# EAGLE design BreakoutBoard (EAGLE 9.6.2)

## Sheet 1 of 2: Audio & Power
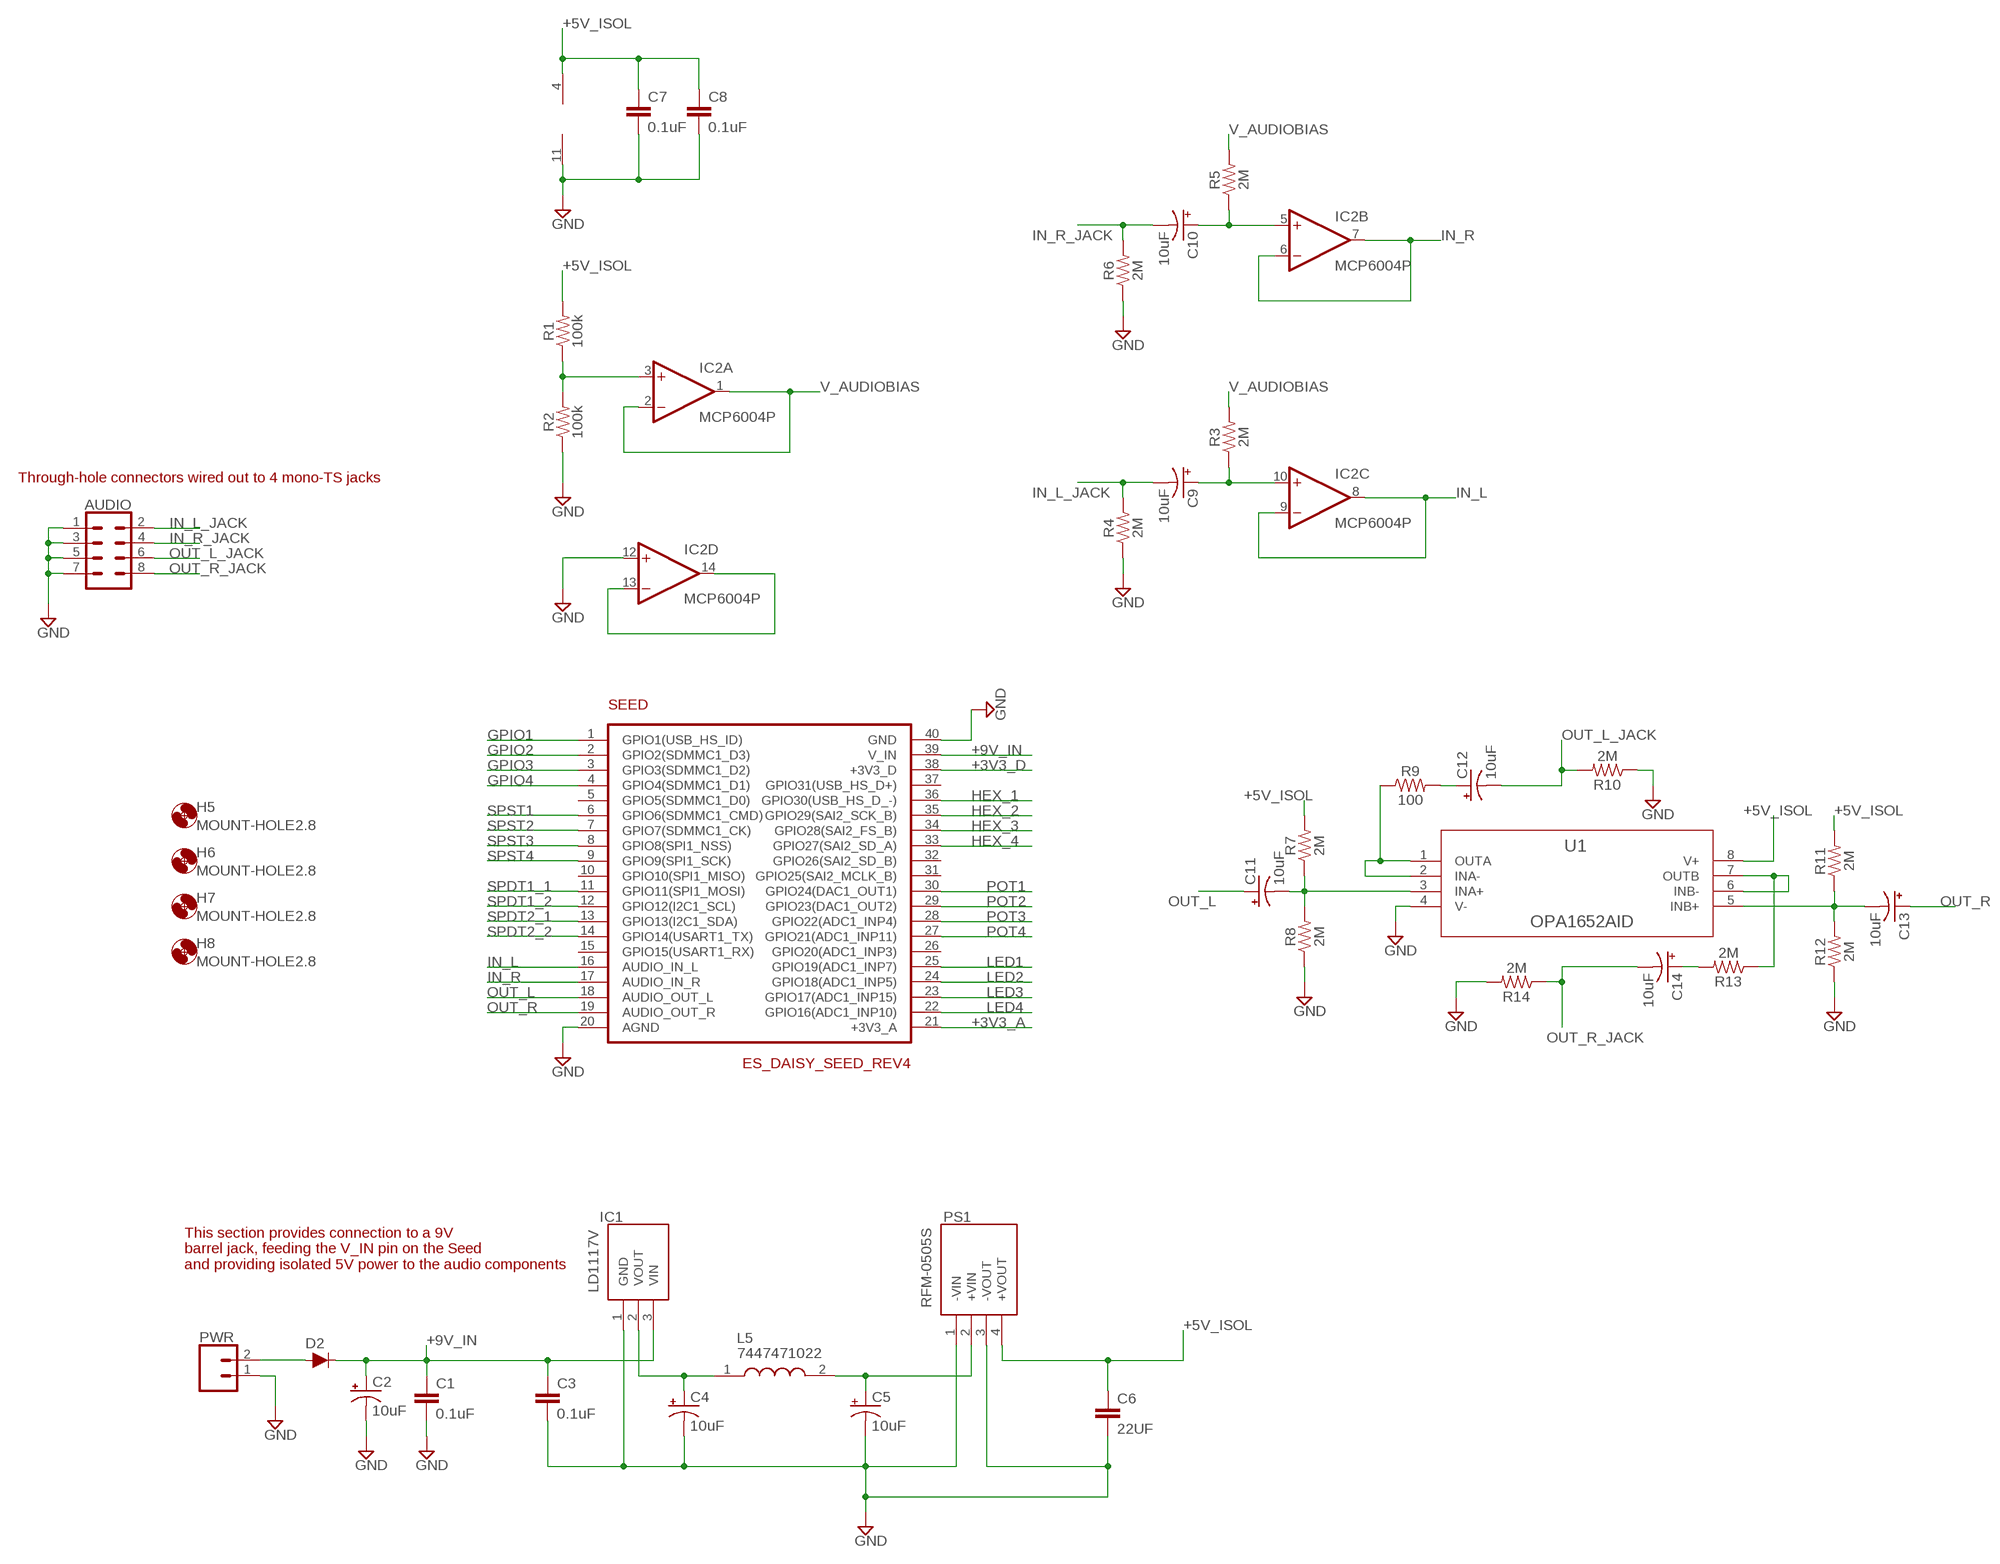
[diagram p0: schematic, sheet 1]

### Parts
AUDIO  CONN_04X2  [2X4]
C1  0.1uF  0.1UF-KIT-EZ-50V-20%  [CAP-PTH-SMALL-KIT]
C2  10uF  10UF-POLAR-RADIAL-2.5MM-25V-20%  [CPOL-RADIAL-2.5MM-5MM]
C3  0.1uF  0.1UF-KIT-EZ-50V-20%  [CAP-PTH-SMALL-KIT]
C4  10uF  10UF-POLAR-RADIAL-2.5MM-25V-20%  [CPOL-RADIAL-2.5MM-5MM]
C5  10uF  10UF-POLAR-RADIAL-2.5MM-25V-20%  [CPOL-RADIAL-2.5MM-5MM]
C6  22UF  [CAP-PTH-SMALL-KIT]
C7  0.1uF  0.1UF-KIT-EZ-50V-20%  [CAP-PTH-SMALL-KIT]
C8  0.1uF  0.1UF-KIT-EZ-50V-20%  [CAP-PTH-SMALL-KIT]
C9  10uF  10UF-POLAR-RADIAL-2.5MM-25V-20%  [CPOL-RADIAL-2.5MM-5MM]
C10  10uF  10UF-POLAR-RADIAL-2.5MM-25V-20%  [CPOL-RADIAL-2.5MM-5MM]
C11  10uF  10UF-POLAR-RADIAL-2.5MM-25V-20%  [CPOL-RADIAL-2.5MM-5MM]
C12  10uF  10UF-POLAR-RADIAL-2.5MM-25V-20%  [CPOL-RADIAL-2.5MM-5MM]
C13  10uF  10UF-POLAR-RADIAL-2.5MM-25V-20%  [CPOL-RADIAL-2.5MM-5MM]
C14  10uF  10UF-POLAR-RADIAL-2.5MM-25V-20%  [CPOL-RADIAL-2.5MM-5MM]
D2  200mA/100V/1V  DIODE-1N4148  [DIODE-1N4148]
H5  MOUNT-HOLE2.8  [2,8]
H6  MOUNT-HOLE2.8  [2,8]
H7  MOUNT-HOLE2.8  [2,8]
H8  MOUNT-HOLE2.8  [2,8]
IC1  LD1117V  [TO255P460X1020X2008-3P]
IC2  MCP6004P  [DIL14]
L5  7447471022  [WE-TIS_111190]
PS1  RFM-0505S  [RFM0505S]
PWR  CONN_02  [1X02]
R1  100k  100KOHM-HORIZ-1/4W-5%  [AXIAL-0.3]
R2  100k  100KOHM-HORIZ-1/4W-5%  [AXIAL-0.3]
R3  2M  2MOHM-HORIZ-1/4W-5%  [AXIAL-0.3]
R4  2M  2MOHM-HORIZ-1/4W-5%  [AXIAL-0.3]
R5  2M  2MOHM-HORIZ-1/4W-5%  [AXIAL-0.3]
R6  2M  2MOHM-HORIZ-1/4W-5%  [AXIAL-0.3]
R7  2M  2MOHM-HORIZ-1/4W-5%  [AXIAL-0.3]
R8  2M  2MOHM-HORIZ-1/4W-5%  [AXIAL-0.3]
R9  100  100OHM-HORIZ-1/4W-1%  [AXIAL-0.3]
R10  2M  2MOHM-HORIZ-1/4W-5%  [AXIAL-0.3]
R11  2M  2MOHM-HORIZ-1/4W-5%  [AXIAL-0.3]
R12  2M  2MOHM-HORIZ-1/4W-5%  [AXIAL-0.3]
R13  2M  2MOHM-HORIZ-1/4W-5%  [AXIAL-0.3]
R14  2M  2MOHM-HORIZ-1/4W-5%  [AXIAL-0.3]
SEED  ES_DAISY_SEED_REV4  [ES_DAISY_SEED]
U1  OPA1652AID  [D8]

### Nets
+3V3_A: SEED.21(+3V3_A) ; also sheet 2
+3V3_D: SEED.38(+3V3_D)
+5V_ISOL: C6.1 C7.1 C8.1 IC2.4(P:V+) PS1.4(+VOUT) R1.P$2 R7.P$2 R11.P$2 U1.8(V+)
+9V_IN: C1.1 C2.1(+) C3.1 D2.C IC1.3(VIN) SEED.39(V_IN)
GND: AUDIO.1 AUDIO.3 AUDIO.5 AUDIO.7 C1.2 C2.2(-) C3.2 C4.2(-) C5.2(-) C6.2 C7.2 C8.2 IC1.1(GND) IC2.11(P:V-) IC2.12(D:+IN) PS1.1(-VIN) PS1.3(-VOUT) PWR.1 R2.P$1 R4.P$1 R6.P$1 R8.P$1 R10.P$1 R12.P$1 R14.P$2 SEED.20(AGND) SEED.40(GND) U1.4(V-) ; also sheet 2
GPIO1: SEED.1(GPIO1(USB_HS_ID)) ; also sheet 2
GPIO2: SEED.2(GPIO2(SDMMC1_D3)) ; also sheet 2
GPIO3: SEED.3(GPIO3(SDMMC1_D2)) ; also sheet 2
GPIO4: SEED.4(GPIO4(SDMMC1_D1)) ; also sheet 2
HEX_1: SEED.36(GPIO30(USB_HS_D_-)) ; also sheet 2
HEX_2: SEED.35(GPIO29(SAI2_SCK_B)) ; also sheet 2
HEX_3: SEED.34(GPIO28(SAI2_FS_B)) ; also sheet 2
HEX_4: SEED.33(GPIO27(SAI2_SD_A)) ; also sheet 2
IN_L: IC2.8(C:OUT) IC2.9(C:-IN) SEED.16(AUDIO_IN_L)
IN_L_JACK: AUDIO.2 C9.2(-) R4.P$2
IN_R: IC2.6(B:-IN) IC2.7(B:OUT) SEED.17(AUDIO_IN_R)
IN_R_JACK: AUDIO.4 C10.2(-) R6.P$2
LED1: SEED.25(GPIO19(ADC1_INP7)) ; also sheet 2
LED2: SEED.24(GPIO18(ADC1_INP5)) ; also sheet 2
LED3: SEED.23(GPIO17(ADC1_INP15)) ; also sheet 2
LED4: SEED.22(GPIO16(ADC1_INP10)) ; also sheet 2
N$2: D2.A PWR.2
N$6: IC2.3(A:+IN) R1.P$1 R2.P$2
N$7: C5.1(+) L5.2 PS1.2(+VIN)
N$8: C4.1(+) IC1.2(VOUT) L5.1
N$9: C9.1(+) IC2.10(C:+IN) R3.P$1
N$10: IC2.13(D:-IN) IC2.14(D:OUT)
N$11: C10.1(+) IC2.5(B:+IN) R5.P$1
N$12: C11.2(-) R7.P$1 R8.P$2 U1.3(INA+)
N$13: R9.P$1 U1.1(OUTA) U1.2(INA-)
N$14: C12.1(+) R9.P$2
N$15: C13.2(-) R11.P$1 R12.P$2 U1.5(INB+)
N$16: C14.1(+) R13.P$2
N$17: R13.P$1 U1.6(INB-) U1.7(OUTB)
OUT_L: C11.1(+) SEED.18(AUDIO_OUT_L)
OUT_L_JACK: AUDIO.6 C12.2(-) R10.P$2
OUT_R: C13.1(+) SEED.19(AUDIO_OUT_R)
OUT_R_JACK: AUDIO.8 C14.2(-) R14.P$1
POT1: SEED.30(GPIO24(DAC1_OUT1)) ; also sheet 2
POT2: SEED.29(GPIO23(DAC1_OUT2)) ; also sheet 2
POT3: SEED.28(GPIO22(ADC1_INP4)) ; also sheet 2
POT4: SEED.27(GPIO21(ADC1_INP11)) ; also sheet 2
SPDT1_1: SEED.11(GPIO11(SPI1_MOSI)) ; also sheet 2
SPDT1_2: SEED.12(GPIO12(I2C1_SCL)) ; also sheet 2
SPDT2_1: SEED.13(GPIO13(I2C1_SDA)) ; also sheet 2
SPDT2_2: SEED.14(GPIO14(USART1_TX)) ; also sheet 2
SPST1: SEED.6(GPIO6(SDMMC1_CMD)) ; also sheet 2
SPST2: SEED.7(GPIO7(SDMMC1_CK)) ; also sheet 2
SPST3: SEED.8(GPIO8(SPI1_NSS)) ; also sheet 2
SPST4: SEED.9(GPIO9(SPI1_SCK)) ; also sheet 2
V_AUDIOBIAS: IC2.1(A:OUT) IC2.2(A:-IN) R3.P$2 R5.P$2
Unconnected: SEED.5(GPIO5(SDMMC1_D0)) SEED.10(GPIO10(SPI1_MISO)) SEED.15(GPIO15(USART1_RX)) SEED.26(GPIO20(ADC1_INP3)) SEED.31(GPIO25(SAI2_MCLK_B)) SEED.32(GPIO26(SAI2_SD_B)) SEED.37(GPIO31(USB_HS_D+))

### Notes on the sheet
- Through-hole connectors wired out to 4 mono-TS jacks
- This section provides connection to a 9V
  barrel jack, feeding the V_IN pin on the Seed 
  and providing isolated 5V power to the audio components

## Sheet 2 of 2: I/O
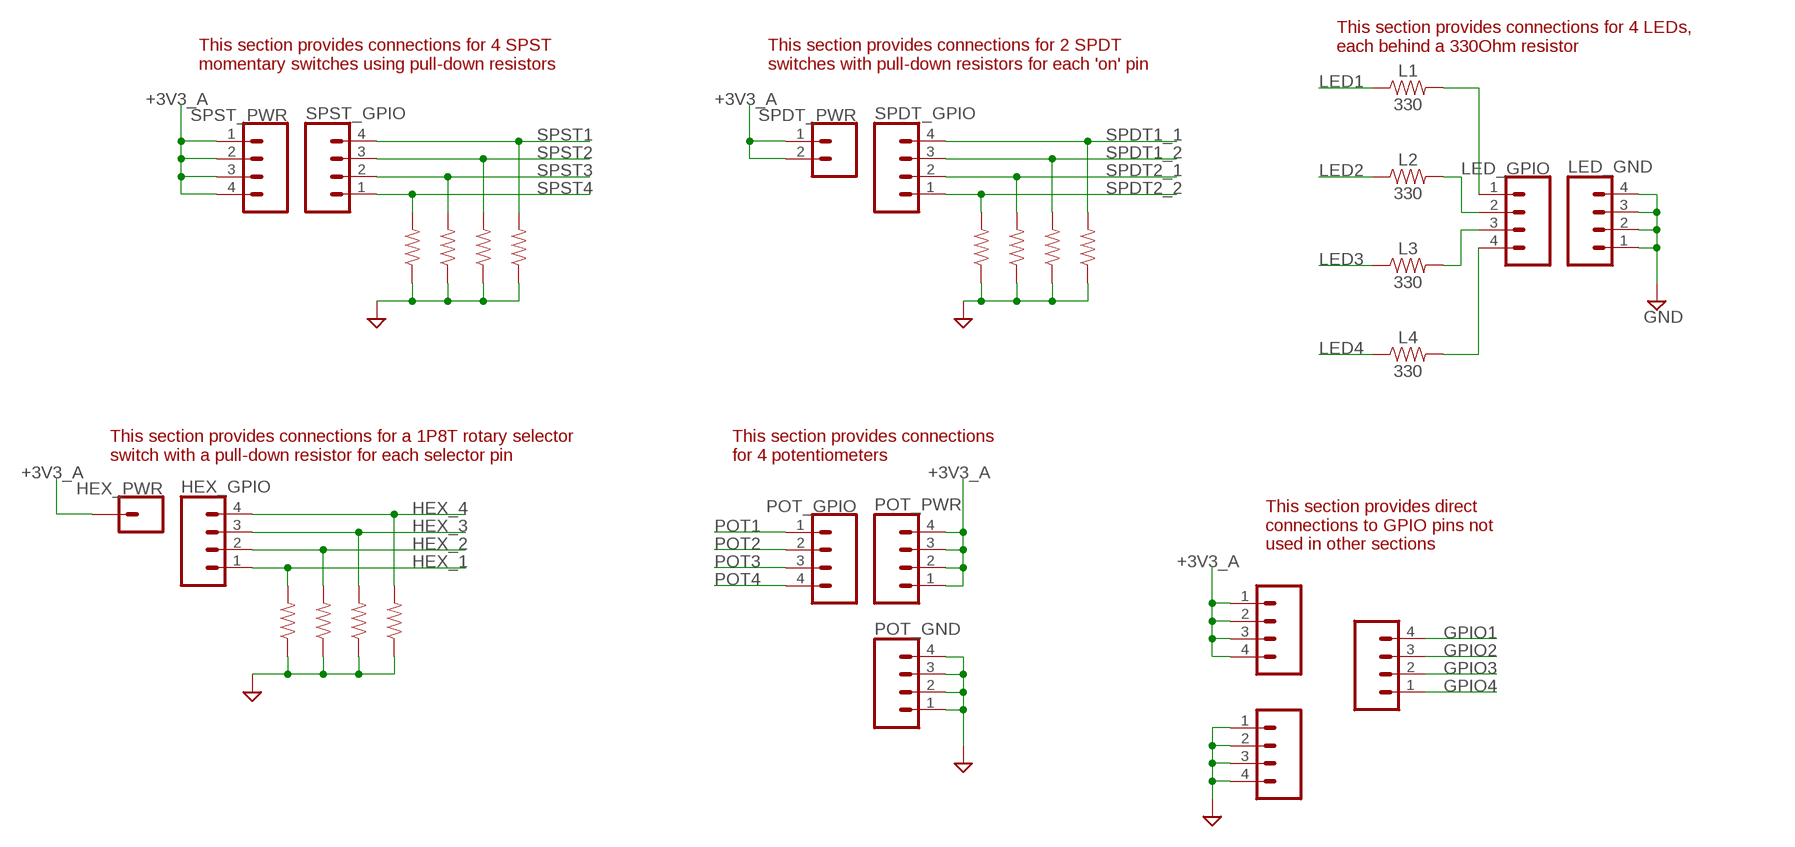
[diagram p1: schematic, sheet 2]

### Parts
D11  10k  10KOHM-HORIZ-1/4W-5%  [AXIAL-0.3]
D12  10k  10KOHM-HORIZ-1/4W-5%  [AXIAL-0.3]
D21  10k  10KOHM-HORIZ-1/4W-5%  [AXIAL-0.3]
D22  10k  10KOHM-HORIZ-1/4W-5%  [AXIAL-0.3]
EX_GND  CONN_04  [1X04]
EX_GPIOS  CONN_04  [1X04]
EX_PWR  CONN_04  [1X04]
H1  10k  10KOHM-HORIZ-1/4W-5%  [AXIAL-0.3]
H2  10k  10KOHM-HORIZ-1/4W-5%  [AXIAL-0.3]
H3  10k  10KOHM-HORIZ-1/4W-5%  [AXIAL-0.3]
H4  10k  10KOHM-HORIZ-1/4W-5%  [AXIAL-0.3]
HEX_GPIO  CONN_04  [1X04]
HEX_PWR  CONN_01  [1X01]
L1  330  330OHM-HORIZ-1/10W-5%  [AXIAL-0.3]
L2  330  330OHM-HORIZ-1/10W-5%  [AXIAL-0.3]
L3  330  330OHM-HORIZ-1/10W-5%  [AXIAL-0.3]
L4  330  330OHM-HORIZ-1/10W-5%  [AXIAL-0.3]
LED_GND  CONN_04  [1X04]
LED_GPIO  CONN_04  [1X04]
POT_GND  CONN_04  [1X04]
POT_GPIO  CONN_04  [1X04]
POT_PWR  CONN_04  [1X04]
S1  10k  10KOHM-HORIZ-1/4W-5%  [AXIAL-0.3]
S2  10k  10KOHM-HORIZ-1/4W-5%  [AXIAL-0.3]
S3  10k  10KOHM-HORIZ-1/4W-5%  [AXIAL-0.3]
S4  10k  10KOHM-HORIZ-1/4W-5%  [AXIAL-0.3]
SPDT_GPIO  CONN_04  [1X04]
SPDT_PWR  CONN_02  [1X02]
SPST_GPIO  CONN_04  [1X04]
SPST_PWR  CONN_04  [1X04]

### Nets
+3V3_A: EX_PWR.1 EX_PWR.2 EX_PWR.3 EX_PWR.4 HEX_PWR.1 POT_PWR.1 POT_PWR.2 POT_PWR.3 POT_PWR.4 SPDT_PWR.1 SPDT_PWR.2 SPST_PWR.1 SPST_PWR.2 SPST_PWR.3 SPST_PWR.4 ; also sheet 1
GND: D11.P$1 D12.P$1 D21.P$1 D22.P$1 EX_GND.1 EX_GND.2 EX_GND.3 EX_GND.4 H1.P$1 H2.P$1 H3.P$1 H4.P$1 LED_GND.1 LED_GND.2 LED_GND.3 LED_GND.4 POT_GND.1 POT_GND.2 POT_GND.3 POT_GND.4 S1.P$1 S2.P$1 S3.P$1 S4.P$1 ; also sheet 1
GPIO1: EX_GPIOS.4 ; also sheet 1
GPIO2: EX_GPIOS.3 ; also sheet 1
GPIO3: EX_GPIOS.2 ; also sheet 1
GPIO4: EX_GPIOS.1 ; also sheet 1
HEX_1: H1.P$2 HEX_GPIO.1 ; also sheet 1
HEX_2: H2.P$2 HEX_GPIO.2 ; also sheet 1
HEX_3: H3.P$2 HEX_GPIO.3 ; also sheet 1
HEX_4: H4.P$2 HEX_GPIO.4 ; also sheet 1
LED1: L1.P$1 ; also sheet 1
LED2: L2.P$1 ; also sheet 1
LED3: L3.P$1 ; also sheet 1
LED4: L4.P$1 ; also sheet 1
N$1: L1.P$2 LED_GPIO.1
N$3: L2.P$2 LED_GPIO.2
N$4: L3.P$2 LED_GPIO.3
N$5: L4.P$2 LED_GPIO.4
POT1: POT_GPIO.1 ; also sheet 1
POT2: POT_GPIO.2 ; also sheet 1
POT3: POT_GPIO.3 ; also sheet 1
POT4: POT_GPIO.4 ; also sheet 1
SPDT1_1: D11.P$2 SPDT_GPIO.4 ; also sheet 1
SPDT1_2: D12.P$2 SPDT_GPIO.3 ; also sheet 1
SPDT2_1: D21.P$2 SPDT_GPIO.2 ; also sheet 1
SPDT2_2: D22.P$2 SPDT_GPIO.1 ; also sheet 1
SPST1: S1.P$2 SPST_GPIO.4 ; also sheet 1
SPST2: S2.P$2 SPST_GPIO.3 ; also sheet 1
SPST3: S3.P$2 SPST_GPIO.2 ; also sheet 1
SPST4: S4.P$2 SPST_GPIO.1 ; also sheet 1

### Notes on the sheet
- This section provides connections for 4 LEDs,
  each behind a 330Ohm resistor
- This section provides connections for 4 SPST 
  momentary switches using pull-down resistors
- This section provides connections for 2 SPDT 
  switches with pull-down resistors for each 'on' pin
- This section provides connections for a 1P8T rotary selector
  switch with a pull-down resistor for each selector pin
- This section provides connections
  for 4 potentiometers
- This section provides direct
  connections to GPIO pins not
  used in other sections

## Library data of the parts
AUDIO = SparkFun-Connectors:CONN_04X2: Multi connection point. Often used as Generic Header-pin footprint for 0.1 inch spaced/style header connections On any of the 0.1 inch spaced packages, you can populate with these: Break Away Headers - Straight <https://www.sparkfun.com/products/116> (PRT-00116) Break Away Male Headers - Right Angle <https://www.sparkfun.com/products/553> (PRT-00553) Female Headers <https://www.sparkfun.com/products/115> (PRT-00115) Break Away Headers - Machine Pin <https://www.sparkfun.com/products/117> (PRT-00117) Break Away Female Headers - Swiss Machine Pin <https://www.sparkfun.com/products/743> (PRT-00743)
C1 C3 C7 C8 = SparkFun-Capacitors:0.1UF: 0.1µF ceramic capacitors A capacitor is a passive two-terminal electrical component used to store electrical energy temporarily in an electric field.; PROD_ID: CAP-08370
C2 C4 C5 C9-C14 = SparkFun-Capacitors:10UF-POLAR: 10.0µF polarized capacitors A capacitor is a passive two-terminal electrical component used to store electrical energy temporarily in an electric field.; PROD_ID: CAP-08440
C6 = Custom-Parts:22UF
D2 = SparkFun-DiscreteSemi:DIODE: Diode These are standard reverse protection diodes and small signal diodes. SparkFun Products: SparkFun SparkPunk Sound Kit <https://www.sparkfun.com/products/11177> SparkFun ESP8266 Thing <https://www.sparkfun.com/products/13231>; PROD_ID: DIO-08378
D11 D12 D21 D22 H1-H4 S1-S4 = SparkFun-Resistors:10KOHM: 10kΩ resistor A resistor is a passive two-terminal electrical component that implements electrical resistance as a circuit element. Resistors act to reduce current flow, and, at the same time, act to lower voltage levels within circuits. - Wikipedia; PROD_ID: RES-09435
EX_GND EX_GPIOS EX_PWR HEX_GPIO LED_GND LED_GPIO POT_GND POT_GPIO POT_PWR SPDT_GPIO SPST_GPIO SPST_PWR = SparkFun-Connectors:CONN_04: Multi connection point. Often used as Generic Header-pin footprint for 0.1 inch spaced/style header connections On any of the 0.1 inch spaced packages, you can populate with these: Break Away Headers - Straight <https://www.sparkfun.com/products/116> (PRT-00116) Break Away Male Headers - Right Angle <https://www.sparkfun.com/products/553> (PRT-00553) Female Headers <https://www.sparkfun.com/products/115> (PRT-00115) Break Away Headers - Machine Pin <https://www.sparkfun.com/products/117> (PRT-00117) Break Away Female Headers - Swiss Machine Pin <https://www.sparkfun.com/products/743> (PRT-00743) For SCREWTERMINALS and SPRING TERMINALS visit here: Screw Terimnals on SparkFun.com <https://www.sparkfun.com/search/results?term=Screw+Terminals> (5mm/3.5mm/2.54mm spacing) This device is also useful as a general connection point to wire up your design to another part of your project. Our various solder wires solder well into these plated through hole pads. Hook-Up Wire - Assortment (Stranded, 22 AWG) <https://www.sparkfun.com/products/11375> (PRT-11375) Hook-Up Wire - Assortment (Solid Core, 22 AWG) <https://www.sparkfun.com/products/11367> (PRT-11367) View the entire wire category on our website here <https://www.sparkfun.com/categories/141> Special notes: Molex polarized connector foot print use with SKU : PRT-08231 with associated crimp pins and housings. 1MM SMD Version SKU: PRT-10208; PROD_ID: CONN-09696
H5-H8 = holes:MOUNT-HOLE: MOUNTING HOLE with drill center marker
HEX_PWR = SparkFun-Connectors:CONN_01: Single connection point. Often used as Generic Header-pin footprint for 0.1 inch spaced/style header connections On any of the 0.1 inch spaced packages, you can populate with these: Break Away Headers - Straight <https://www.sparkfun.com/products/116> (PRT-00116) Break Away Male Headers - Right Angle <https://www.sparkfun.com/products/553> (PRT-00553) Female Headers <https://www.sparkfun.com/products/115> (PRT-00115) Break Away Headers - Machine Pin <https://www.sparkfun.com/products/117> (PRT-00117) Break Away Female Headers - Swiss Machine Pin <https://www.sparkfun.com/products/743> (PRT-00743) This device is also useful as a general connection point to wire up your design to another part of your project. Our various solder wires solder well into these plated through hole pads. Hook-Up Wire - Assortment (Stranded, 22 AWG) <https://www.sparkfun.com/products/11375> (PRT-11375) Hook-Up Wire - Assortment (Solid Core, 22 AWG) <https://www.sparkfun.com/products/11367> (PRT-11367) View the entire wire category on our website here <https://www.sparkfun.com/categories/141> Special notes: SMTSO-256-ET is a "flush mount" nut for a 4-40 screw. We mostly use this on specialty testbeds; it is a nice way to connect hardware to your PCB at an adjustable hieght. Also note, the SNAP packages are for using a snappable style connector. We sell a baggie of snaps and they are also used on two LilyPad designs: Snap Assortment - 30 pack (male and female) <https://www.sparkfun.com/products/11347> (DEV-11347) LilyPad Arduino SimpleSnap <https://www.sparkfun.com/products/10941> (DEV-10941) LilyPad SimpleSnap Protoboard <https://www.sparkfun.com/products/10940> (DEV-10940)
IC1 = SamacSys_Parts:LD1117V: I.C. LD1117V Source: Datasheet <https://www.mouser.com/datasheet/2/389/ld1117-974075.pdf>; ARROW_PART_NUMBER: LD1117V; ARROW_PRICE-STOCK: https://www.arrow.com/en/products/ld1117v/stmicroelectronics; DESCRIPTION: I.C. LD1117V; HEIGHT: 4.6mm; MANUFACTURER_NAME: STMicroelectronics; MANUFACTURER_PART_NUMBER: LD1117V; MOUSER_PART_NUMBER: 511-LD1117V; MOUSER_PRICE-STOCK: https://www.mouser.co.uk/ProductDetail/STMicroelectronics/LD1117V?qs=tZUCD5p2VWqhC74a4KMNzA%3D%3D
IC2 = Custom-Parts:MCP6004: Quad Op Amp 2.7V to 6.0V Single Supply CMOS Source: https://www.mouser.com/datasheet/2/268/21733e-41017.pdf
L1-L4 = SparkFun-Resistors:330OHM: 330Ω resistor A resistor is a passive two-terminal electrical component that implements electrical resistance as a circuit element. Resistors act to reduce current flow, and, at the same time, act to lower voltage levels within circuits. - Wikipedia; PROD_ID: RES-8371
L5 = SamacSys_Parts:7447471022: Wurth 2.2 uH +/-20% Ferrite Leaded Inductor, Max SRF:75MHz, 10A Idc, 0.009 Rdc WE-TIS Source: Datasheet <https://componentsearchengine.com/Datasheets/1/7447471022.pdf>; DESCRIPTION: Wurth 2.2 uH +/-20% Ferrite Leaded Inductor, Max SRF:75MHz, 10A Idc, 0.009 Rdc WE-TIS; HEIGHT: mm; MANUFACTURER_NAME: Wurth Elektronik; MANUFACTURER_PART_NUMBER: 7447471022; MOUSER_PART_NUMBER: 710-7447471022; MOUSER_PRICE-STOCK: https://www.mouser.com/Search/Refine.aspx?Keyword=710-7447471022
PS1 = SamacSys_Parts:RFM-0505S: RECOM POWER - RFM-0505S - DC-DC CONVERTER, 5V, 0.2A Source: Datasheet <https://www.recom-power.com/pdf/Econoline/RFM.pdf>; DESCRIPTION: RECOM POWER - RFM-0505S - DC-DC CONVERTER, 5V, 0.2A; HEIGHT: 10.5mm; MANUFACTURER_NAME: RECOM Power; MANUFACTURER_PART_NUMBER: RFM-0505S; MOUSER_PART_NUMBER: 919-RFM-0505S; MOUSER_PRICE-STOCK: https://www.mouser.co.uk/ProductDetail/RECOM-Power/RFM-0505S?qs=lYGu3FyN48dRVYKTH5ipqg%3D%3D
PWR SPDT_PWR = SparkFun-Connectors:CONN_02: Multi connection point. Often used as Generic Header-pin footprint for 0.1 inch spaced/style header connections On any of the 0.1 inch spaced packages, you can populate with these: Break Away Headers - Straight <https://www.sparkfun.com/products/116> (PRT-00116) Break Away Male Headers - Right Angle <https://www.sparkfun.com/products/553> (PRT-00553) Female Headers <https://www.sparkfun.com/products/115> (PRT-00115) Break Away Headers - Machine Pin <https://www.sparkfun.com/products/117> (PRT-00117) Break Away Female Headers - Swiss Machine Pin <https://www.sparkfun.com/products/743> (PRT-00743) For SCREWTERMINALS and SPRING TERMINALS visit here: Screw Terimnals on SparkFun.com <https://www.sparkfun.com/search/results?term=Screw+Terminals> (5mm/3.5mm/2.54mm spacing) This device is also useful as a general connection point to wire up your design to another part of your project. Our various solder wires solder well into these plated through hole pads. Hook-Up Wire - Assortment (Stranded, 22 AWG) <https://www.sparkfun.com/products/11375> (PRT-11375) Hook-Up Wire - Assortment (Solid Core, 22 AWG) <https://www.sparkfun.com/products/11367> (PRT-11367) View the entire wire category on our website here <https://www.sparkfun.com/categories/141> Special notes: Molex polarized connector foot print use with: PRT-08233 with associated crimp pins and housings. 2.54_SCREWTERM for use with PRT-10571. 3.5mm Screw Terminal footprints for PRT-08084 5mm Screw Terminal footprints for use with PRT-08432
R1 R2 = SparkFun-Resistors:100KOHM: 100kΩ resistor A resistor is a passive two-terminal electrical component that implements electrical resistance as a circuit element. Resistors act to reduce current flow, and, at the same time, act to lower voltage levels within circuits. - Wikipedia; PROD_ID: RES-10686
R3-R8 R10-R14 = Custom-Parts:2MOHM: 2MΩ resistor A resistor is a passive two-terminal electrical component that implements electrical resistance as a circuit element. Resistors act to reduce current flow, and, at the same time, act to lower voltage levels within circuits. - Wikipedia; PROD_ID: RES-09329
R9 = SparkFun-Resistors:100OHM: 100Ω resistor A resistor is a passive two-terminal electrical component that implements electrical resistance as a circuit element. Resistors act to reduce current flow, and, at the same time, act to lower voltage levels within circuits. - Wikipedia; PROD_ID: RES-12181
SEED = Electrosmith-Boards:ES_DAISY_SEED_REV4; IPN: Daisy Seed
U1 = Custom-Parts:OPA1652AID; DATASHEET_URL: http://www.ti.com/lit/gpn/OPA1652; DESCRIPTION: Sound Plus Low Noise and Distortion, General-Purpose, FET-Input Audio Op Amps; FAMILY_NAME: LOW NOISE; GENERIC_PART_NUMBER: OPA1652; INDUSTRY_STD_PKG_TYPE: SOIC; MANUFACTURER: Texas Instruments; MANUFACTURER_PART_NUMBER: OPA1652AID; PACKAGE_DESIGNATOR: D; PIN_COUNT: 8; VENDOR: Texas Instruments

## Net classes
0 DEFAULT: width 0.102 mm, drill 0.2 mm, clearance 0.102 mm

## Board
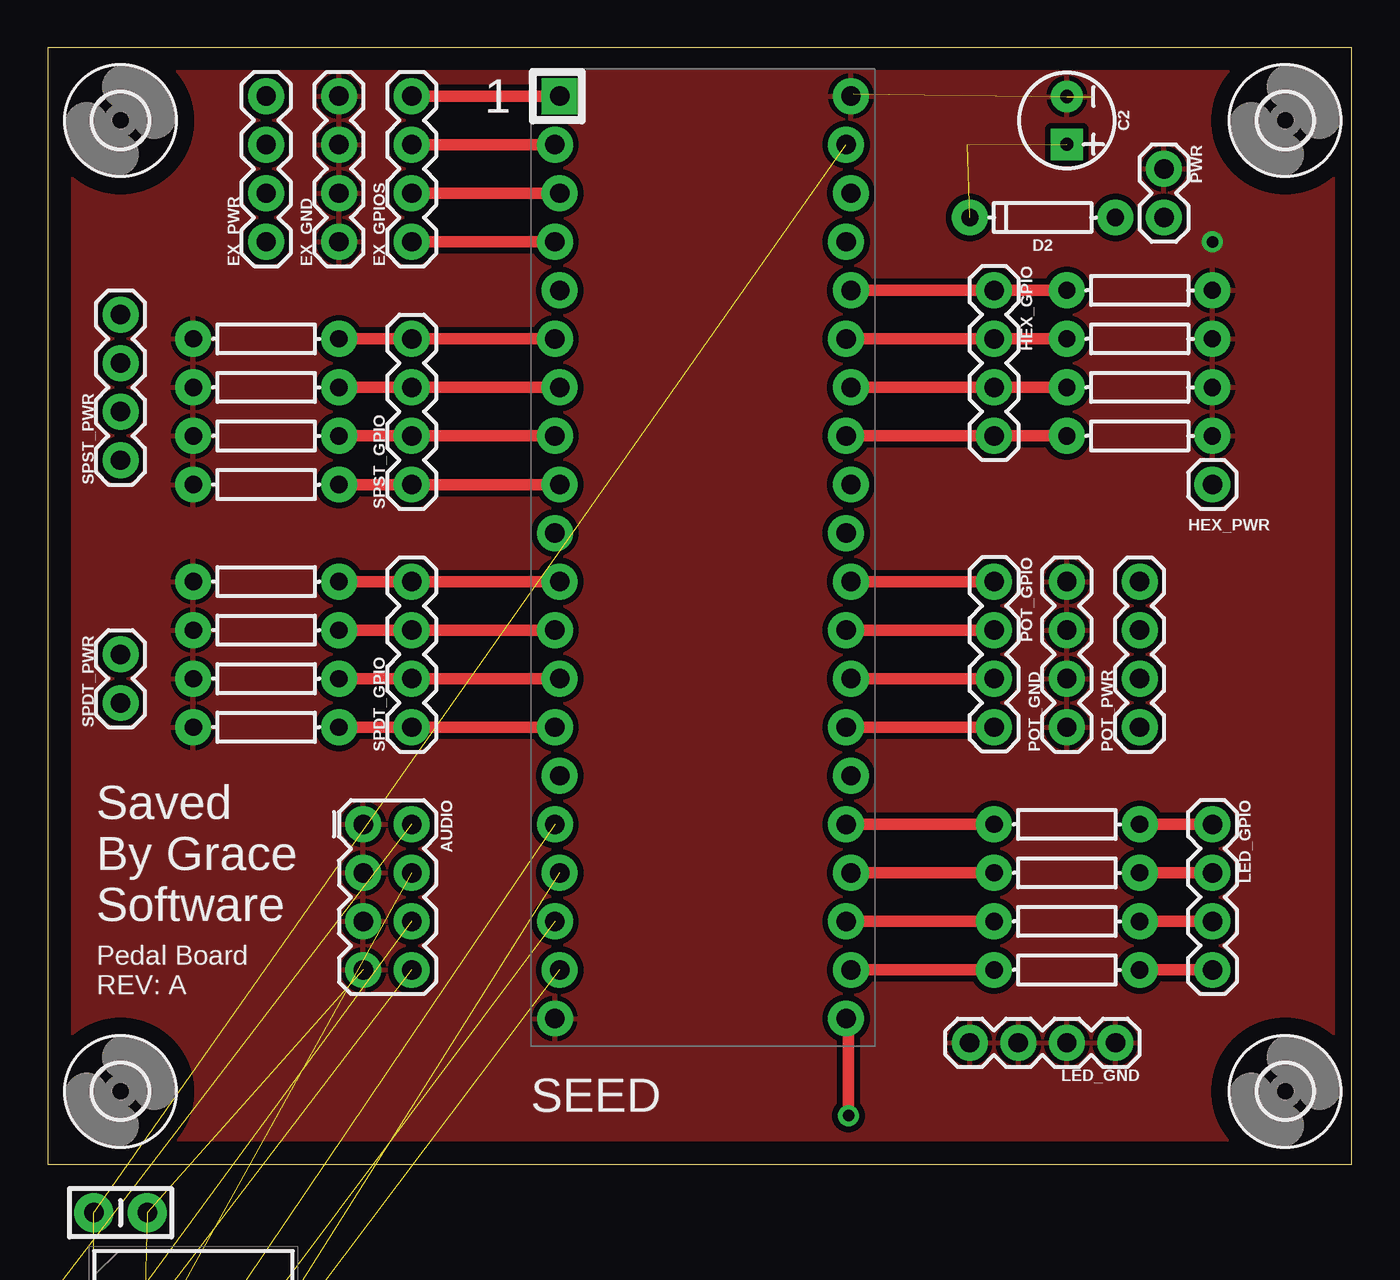
[diagram p2: board, top side]
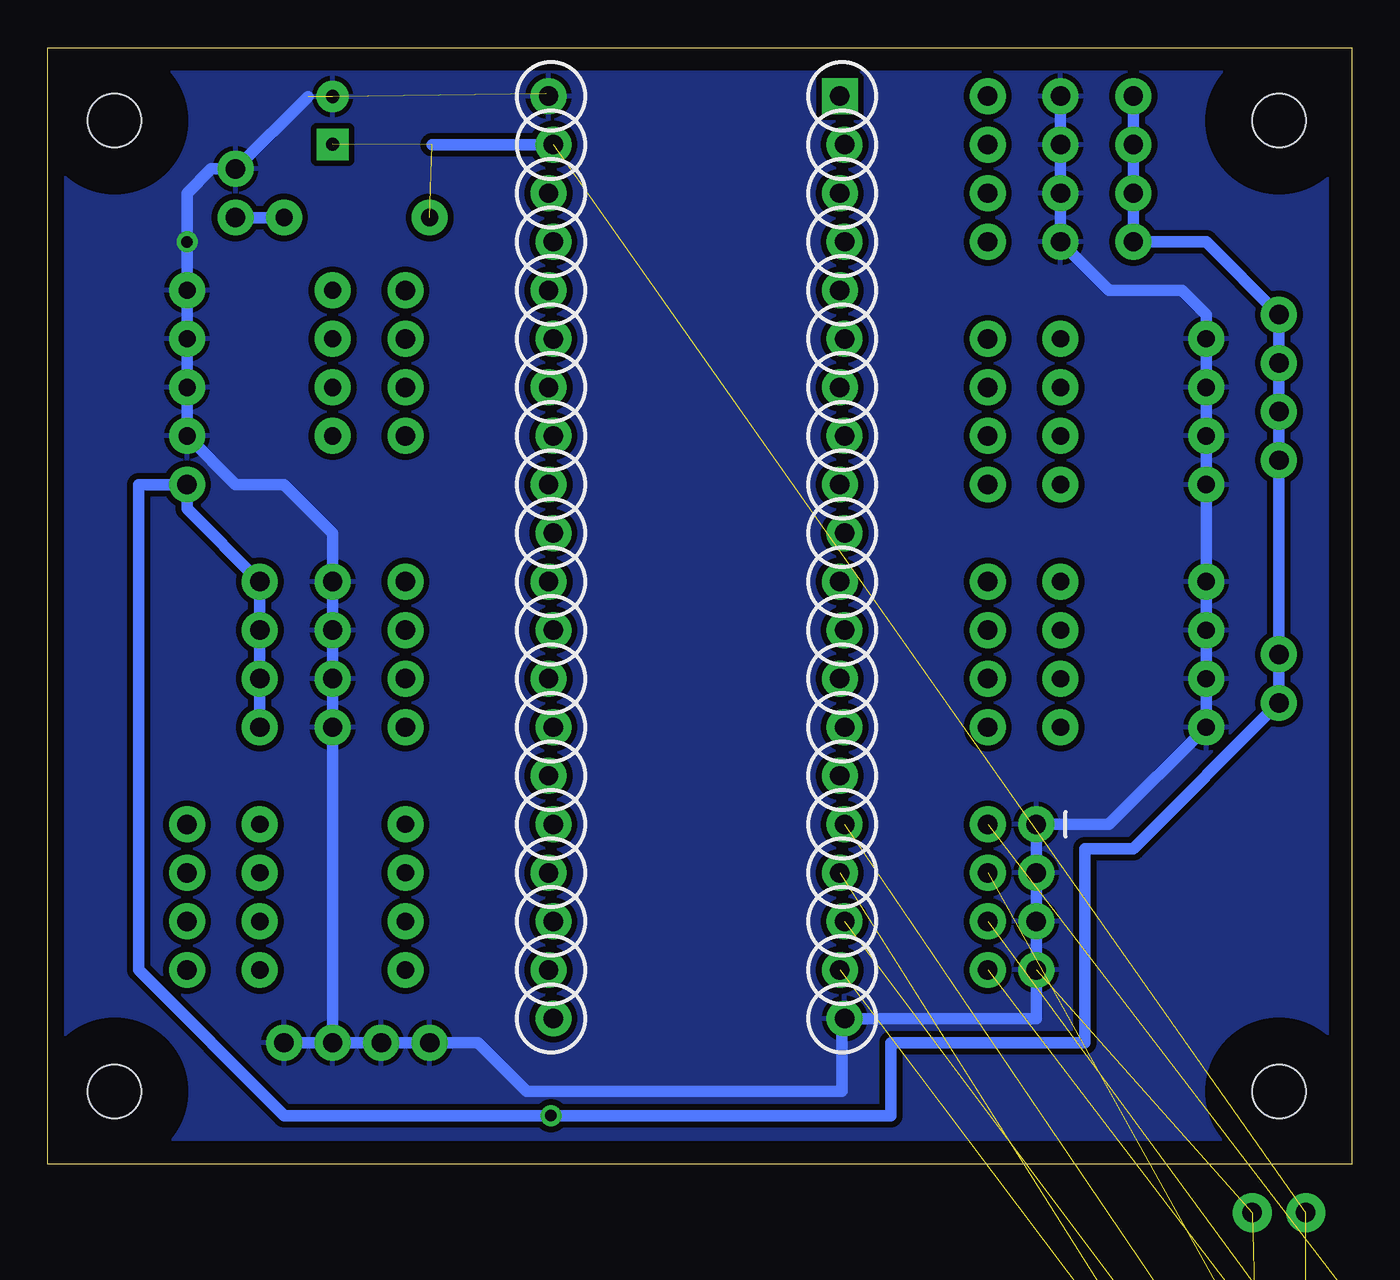
[diagram p3: board, bottom side, seen from below]

Size 68.25 x 58.41 mm. Coordinates in mm from the lower left corner, seen from the top.
Outline: 0,0 68.25,0 68.25,58.41 0,58.41 0,0
Copper layers (1*16): Top 0.035mm / dielectric 1.5mm / Bottom 0.035mm
Design rules "SparkFun": minimum track width 8mil, minimum drill 20mil, track to track 8mil, track to pad 8mil, pad to pad 8mil, via to via 8mil, smd to smd 8mil, copper to edge 8mil, drill to drill 8mil, minimum pad ring 12mil, minimum via ring 10mil, stop-mask expansion 4mil, vias tented up to drill 20mil, thermal gap 10mil

### Footprints (pad centres in the part's own frame; a part is rotated, then mirrored left to right if it is on the bottom)
2X4 = drill 1.016 pad 1.88: 1 -3.81,-1.27; 2 -3.81,1.27; 3 -1.27,-1.27; 4 -1.27,1.27; 5 1.27,-1.27; 6 1.27,1.27; 7 3.81,-1.27; 8 3.81,1.27
CAP-PTH-SMALL-KIT = drill 1.016 pad 2.032: 1 -1.397,0; 2 1.397,0
CPOL-RADIAL-2.5MM-5MM = drill 0.7 pad 1.651 square: 1 1.25,0 | drill 0.7 pad 1.651: 2 -1.25,0
DIODE-1N4148 = drill 0.9 pad 1.88: A -3.81,0; C 3.81,0
AXIAL-0.3 = drill 0.9 pad 1.88: P$1 -3.81,0; P$2 3.81,0
1X04 = drill 1.016 pad 1.88: 1 0,0; 2 2.54,0; 3 5.08,0; 4 7.62,0
2,8 = hole 2.8: 0,0
1X01 = drill 1.016 pad 1.88: 1 0,0
TO255P460X1020X2008-3P = drill 1.32 pad 1.98 square: 1 0,0 | drill 1.32 pad 1.98: 2 2.55,0; 3 5.1,0
DIL14 = drill 0.813 long: 1 -7.62,-3.81; 2 -5.08,-3.81; 3 -2.54,-3.81; 4 0,-3.81; 5 2.54,-3.81; 6 5.08,-3.81; 7 7.62,-3.81; 8 7.62,3.81; 9 5.08,3.81; 10 2.54,3.81; 11 0,3.81; 12 -2.54,3.81; 13 -5.08,3.81; 14 -7.62,3.81
WE-TIS_111190 = drill 1 pad 1.5: 1 -2.5,0; 2 2.5,0
RFM0505S = drill 1.15 pad 1.725: 1 0,0; 2 2.54,0; 3 5.08,0; 4 7.62,0
1X02 = drill 1.016 pad 1.88: 1 0,0; 2 2.54,0
ES_DAISY_SEED = drill 1.016 pad 1.88 square: 1 -7.493,24.13 | drill 1.016 pad 1.88: 2 -7.747,21.59; 3 -7.493,19.05; 4 -7.747,16.51; 5 -7.493,13.97; 6 -7.747,11.43; 7 -7.493,8.89; 8 -7.747,6.35; 9 -7.493,3.81; 10 -7.747,1.27; 11 -7.493,-1.27; 12 -7.747,-3.81; 13 -7.493,-6.35; 14 -7.747,-8.89; 15 -7.493,-11.43; 16 -7.747,-13.97; 17 -7.493,-16.51; 18 -7.747,-19.05; 19 -7.493,-21.59; 20 -7.747,-24.13; 21 7.493,-24.13; 22 7.747,-21.59; 23 7.493,-19.05; 24 7.747,-16.51; 25 7.493,-13.97; 26 7.747,-11.43; 27 7.493,-8.89; 28 7.747,-6.35; 29 7.493,-3.81; 30 7.747,-1.27; 31 7.493,1.27; 32 7.747,3.81; 33 7.493,6.35; 34 7.747,8.89; 35 7.493,11.43; 36 7.747,13.97; 37 7.493,16.51; 38 7.747,19.05; 39 7.493,21.59; 40 7.747,24.13
D8 = smd 1.981 x 0.559: 1 -2.464,1.905; 2 -2.464,0.635; 3 -2.464,-0.635; 4 -2.464,-1.905; 5 2.464,-1.905; 6 2.464,-0.635; 7 2.464,0.635; 8 2.464,1.905

### Placement (x,y rotation side)
AUDIO  17.78,13.97 270 top
C1  3.81,-11.43 0 top  (outside the outline)
C2  53.34,54.61 270 top
C3  3.81,-2.54 0 top
C4  -3.81,-8.89 0 top  (outside the outline)
C5  -10.16,-8.89 0 top  (outside the outline)
C6  -31.75,-41.91 0 top  (outside the outline)
C7  -31.75,-57.15 0 top  (outside the outline)
C8  -31.75,-60.96 0 top  (outside the outline)
C9  -38.1,-58.42 0 top  (outside the outline)
C10  -44.45,-73.66 0 top  (outside the outline)
C11  -50.8,-88.9 0 top  (outside the outline)
C12  -57.15,-92.71 0 top  (outside the outline)
C13  -63.5,-107.95 0 top  (outside the outline)
C14  -69.85,-107.95 0 top  (outside the outline)
D2  52.07,49.53 180 top
D11  11.43,30.48 0 top
D12  11.43,27.94 0 top
D21  11.43,25.4 0 top
D22  11.43,22.86 0 top
EX_GND  15.24,48.26 90 top
EX_GPIOS  19.05,48.26 90 top
EX_PWR  11.43,48.26 90 top
H1  57.15,45.72 180 top
H2  57.15,43.18 180 top
H3  57.15,40.64 180 top
H4  57.15,38.1 180 top
H5  3.81,3.81 0 top
H6  3.81,54.61 0 top
H7  64.77,3.81 0 top
H8  64.77,54.61 0 top
HEX_GPIO  49.53,45.72 270 top
HEX_PWR  60.96,35.56 0 top
IC1  5.08,-7.62 0 top  (outside the outline)
IC2  -24.13,-49.53 0 top  (outside the outline)
L1  53.34,17.78 0 top
L2  53.34,15.24 0 top
L3  53.34,12.7 0 top
L4  53.34,10.16 0 top
L5  -19.05,-15.24 0 top  (outside the outline)
LED_GND  55.88,6.35 180 top
LED_GPIO  60.96,17.78 270 top
POT_GND  53.34,22.86 90 top
POT_GPIO  49.53,30.48 270 top
POT_PWR  57.15,22.86 90 top
PS1  -8.89,-22.86 0 top  (outside the outline)
PWR  58.42,52.07 270 top
R1  -30.48,-34.29 0 top  (outside the outline)
R2  -30.48,-38.1 0 top  (outside the outline)
R3  -35.56,-64.77 0 top  (outside the outline)
R4  -35.56,-68.58 0 top  (outside the outline)
R5  -35.56,-72.39 0 top  (outside the outline)
R6  -35.56,-76.2 0 top  (outside the outline)
R7  -41.91,-87.63 0 top  (outside the outline)
R8  -41.91,-91.44 0 top  (outside the outline)
R9  -48.26,-95.25 0 top  (outside the outline)
R10  -54.61,-99.06 0 top  (outside the outline)
R11  -54.61,-102.87 0 top  (outside the outline)
R12  -54.61,-106.68 0 top  (outside the outline)
R13  -54.61,-110.49 0 top  (outside the outline)
R14  -67.31,-114.3 0 top  (outside the outline)
S1  11.43,43.18 0 top
S2  11.43,40.64 0 top
S3  11.43,38.1 0 top
S4  11.43,35.56 0 top
SEED  34.29,31.75 0 top
SPDT_GPIO  19.05,22.86 90 top
SPDT_PWR  3.81,24.13 90 top
SPST_GPIO  19.05,35.56 90 top
SPST_PWR  3.81,36.83 90 top
U1  -43.18,-82.55 0 top  (outside the outline)

### Tracks (layer width: path | path; a pad name or v marks a point on that pad's centre or on a via)
+3V3_A  (via drill 0.6)
  Top 0.61: SEED.21 41.91,7.49 v41.91,2.54
  Bottom 0.61: POT_PWR.1 POT_PWR.2 POT_PWR.3 POT_PWR.4 60.96,34.29 HEX_PWR.1 63.5,35.56 63.5,10.16 55.88,2.54 v41.91,2.54 24.13,2.54 24.13,6.35 13.97,6.35 13.97,16.51 11.43,16.51 SPDT_PWR.1 SPDT_PWR.2 SPST_PWR.1 SPST_PWR.2 SPST_PWR.3 SPST_PWR.4 7.62,48.26 EX_PWR.1 EX_PWR.2 EX_PWR.3 EX_PWR.4
+5V_ISOL  (8 unrouted)
+9V_IN  (5 unrouted)
  Bottom 0.61: SEED.39 48.13,53.34
GND  (via drill 0.6)  (22 unrouted)
  Bottom 0.61: LED_GND.2 LED_GND.3 LED_GND.4 45.72,6.35 43.18,3.81 26.67,3.81 26.67,7.49 SEED.20 16.51,7.62 AUDIO.7 AUDIO.5 AUDIO.3 AUDIO.1 12.7,17.78 D22.P$1 D21.P$1 D12.P$1 D11.P$1 S4.P$1 S3.P$1 S2.P$1 S1.P$1 7.62,44.45 8.89,45.72 12.7,45.72 EX_GND.1 EX_GND.2 EX_GND.3 EX_GND.4 | LED_GND.2 LED_GND.1 | 54.63,55.86 PWR.1 59.69,52.07 60.96,50.8 v60.96,48.26 H1.P$1 H2.P$1 H3.P$1 H4.P$1 58.42,35.56 55.88,35.56 53.34,33.02 POT_GND.4 POT_GND.3 POT_GND.2 POT_GND.1 LED_GND.2 | 42.16,56.01 SEED.40
  pour Top (isolate 0.305): 1.27,57.15 1.27,1.27 67.31,1.27 67.31,57.15
  pour Bottom (isolate 0.305): 1.27,57.15 1.27,1.27 67.31,1.27 67.31,57.15
GPIO1
  Top 0.61: SEED.1 EX_GPIOS.4
GPIO2
  Top 0.61: SEED.2 EX_GPIOS.3
GPIO3
  Top 0.61: SEED.3 EX_GPIOS.2
GPIO4
  Top 0.61: SEED.4 EX_GPIOS.1
HEX_1
  Top 0.61: H1.P$2 HEX_GPIO.1 SEED.36
HEX_2
  Top 0.61: H2.P$2 HEX_GPIO.2 SEED.35
HEX_3
  Top 0.61: H3.P$2 HEX_GPIO.3 SEED.34
HEX_4
  Top 0.61: H4.P$2 HEX_GPIO.4 SEED.33
IN_L  (2 unrouted)
IN_L_JACK  (2 unrouted)
IN_R  (2 unrouted)
IN_R_JACK  (2 unrouted)
LED1
  Top 0.61: L1.P$1 SEED.25
LED2
  Top 0.61: L2.P$1 SEED.24
LED3
  Top 0.61: L3.P$1 SEED.23
LED4
  Top 0.61: L4.P$1 SEED.22
N$1
  Top 0.61: LED_GPIO.1 L1.P$2
N$2
  Bottom 0.61: D2.A PWR.2
N$3
  Top 0.61: LED_GPIO.2 L2.P$2
N$4
  Top 0.61: LED_GPIO.3 L3.P$2
N$5
  Top 0.61: LED_GPIO.4 L4.P$2
N$6  (2 unrouted)
N$7  (2 unrouted)
N$8  (2 unrouted)
N$9  (2 unrouted)
N$10  (1 unrouted)
N$11  (2 unrouted)
N$12  (3 unrouted)
N$13  (2 unrouted)
N$14  (1 unrouted)
N$15  (3 unrouted)
N$16  (1 unrouted)
N$17  (2 unrouted)
OUT_L  (1 unrouted)
OUT_L_JACK  (2 unrouted)
OUT_R  (1 unrouted)
OUT_R_JACK  (2 unrouted)
POT1
  Top 0.61: POT_GPIO.1 SEED.30
POT2
  Top 0.61: POT_GPIO.2 SEED.29
POT3
  Top 0.61: POT_GPIO.3 SEED.28
POT4
  Top 0.61: POT_GPIO.4 SEED.27
SPDT1_1
  Top 0.61: SEED.11 SPDT_GPIO.4 D11.P$2
SPDT1_2
  Top 0.61: SEED.12 SPDT_GPIO.3 D12.P$2
SPDT2_1
  Top 0.61: SEED.13 SPDT_GPIO.2 D21.P$2
SPDT2_2
  Top 0.61: SEED.14 SPDT_GPIO.1 D22.P$2
SPST1
  Top 0.61: SEED.6 SPST_GPIO.4 S1.P$2
SPST2
  Top 0.61: SEED.7 SPST_GPIO.3 S2.P$2
SPST3
  Top 0.61: SEED.8 SPST_GPIO.2 S3.P$2
SPST4
  Top 0.61: SEED.9 SPST_GPIO.1 S4.P$2
V_AUDIOBIAS  (3 unrouted)

### Text on the board
tPlace: Saved / By Grace / Software | Pedal Board / REV: A